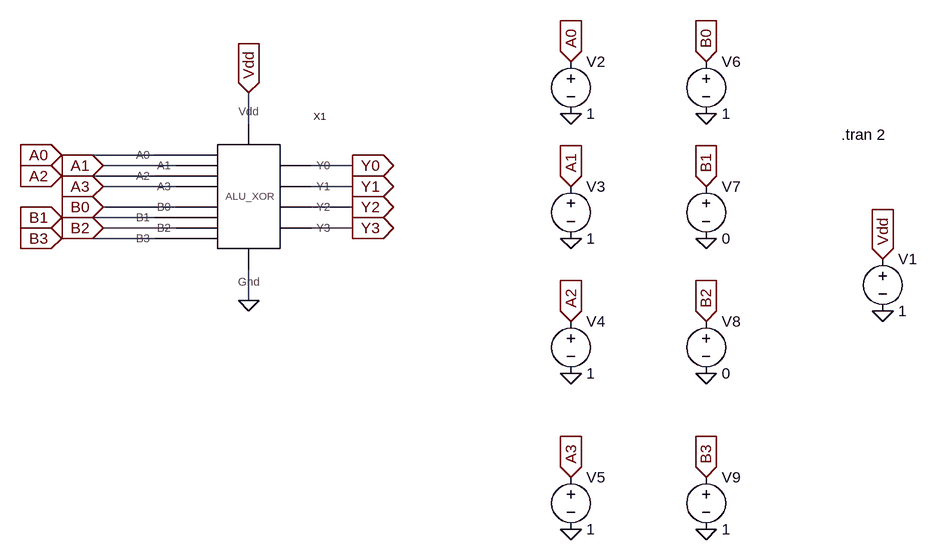
[diagram p0: schematic ALU_XOR_Test.asc]
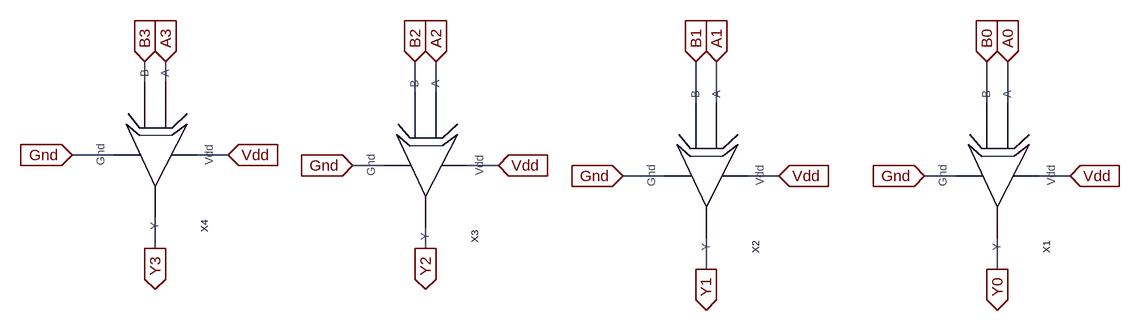
[diagram p1: sub-circuit alu_xor.asc]
ALU_XOR_Test.asc, the LTspice schematic file:
Version 4
SHEET 1 1368 932
WIRE 320 48 320 0
WIRE 176 96 32 96
WIRE 208 112 96 112
WIRE 480 112 416 112
WIRE 176 128 32 128
WIRE 208 144 96 144
WIRE 480 144 416 144
WIRE 208 176 96 176
WIRE 480 176 416 176
WIRE 176 192 32 192
WIRE 208 208 96 208
WIRE 480 208 416 208
WIRE 176 224 32 224
WIRE 320 320 320 272
FLAG 320 0 Vdd
IOPIN 320 0 In
FLAG 32 96 A0
IOPIN 32 96 In
FLAG 96 112 A1
IOPIN 96 112 In
FLAG 32 128 A2
IOPIN 32 128 In
FLAG 96 144 A3
IOPIN 96 144 In
FLAG 96 176 B0
IOPIN 96 176 In
FLAG 32 192 B1
IOPIN 32 192 In
FLAG 96 208 B2
IOPIN 96 208 In
FLAG 32 224 B3
IOPIN 32 224 In
FLAG 480 112 Y0
IOPIN 480 112 Out
FLAG 480 144 Y1
IOPIN 480 144 Out
FLAG 480 176 Y2
IOPIN 480 176 Out
FLAG 480 208 Y3
IOPIN 480 208 Out
FLAG 320 320 0
FLAG 1296 256 Vdd
IOPIN 1296 256 In
FLAG 1296 336 0
FLAG 816 -48 A0
IOPIN 816 -48 In
FLAG 816 144 A1
IOPIN 816 144 In
FLAG 816 352 A2
IOPIN 816 352 In
FLAG 816 592 A3
IOPIN 816 592 In
FLAG 1024 -48 B0
IOPIN 1024 -48 In
FLAG 1024 144 B1
IOPIN 1024 144 In
FLAG 1024 352 B2
IOPIN 1024 352 In
FLAG 1024 592 B3
IOPIN 1024 592 In
FLAG 816 32 0
FLAG 1024 32 0
FLAG 816 224 0
FLAG 1024 224 0
FLAG 816 432 0
FLAG 1024 432 0
FLAG 1024 672 0
FLAG 816 672 0
SYMBOL ALU_XOR 336 144 R0
SYMATTR InstName X1
SYMBOL voltage 1296 240 R0
WINDOW 123 0 0 Left 0
WINDOW 39 0 0 Left 0
SYMATTR InstName V1
SYMATTR Value 1
SYMBOL voltage 816 -64 R0
WINDOW 123 0 0 Left 0
WINDOW 39 0 0 Left 0
SYMATTR InstName V2
SYMATTR Value 1
SYMBOL voltage 816 128 R0
WINDOW 123 0 0 Left 0
WINDOW 39 0 0 Left 0
SYMATTR InstName V3
SYMATTR Value 1
SYMBOL voltage 816 336 R0
WINDOW 123 0 0 Left 0
WINDOW 39 0 0 Left 0
SYMATTR InstName V4
SYMATTR Value 1
SYMBOL voltage 816 576 R0
WINDOW 123 0 0 Left 0
WINDOW 39 0 0 Left 0
SYMATTR InstName V5
SYMATTR Value 1
SYMBOL voltage 1024 -64 R0
WINDOW 123 0 0 Left 0
WINDOW 39 0 0 Left 0
SYMATTR InstName V6
SYMATTR Value 1
SYMBOL voltage 1024 128 R0
WINDOW 123 0 0 Left 0
WINDOW 39 0 0 Left 0
SYMATTR InstName V7
SYMATTR Value 0
SYMBOL voltage 1024 336 R0
WINDOW 123 0 0 Left 0
WINDOW 39 0 0 Left 0
SYMATTR InstName V8
SYMATTR Value 0
SYMBOL voltage 1024 576 R0
WINDOW 123 0 0 Left 0
WINDOW 39 0 0 Left 0
SYMATTR InstName V9
SYMATTR Value 1
TEXT 1232 64 Left 2 !.tran 2

alu_xor.asc, the sub-circuit schematic file:
Version 4
SHEET 1 880 680
WIRE -800 48 -800 16
WIRE -768 48 -768 16
WIRE -384 64 -384 16
WIRE -352 64 -352 16
WIRE 48 80 48 16
WIRE 80 80 80 16
WIRE 496 80 496 16
WIRE 528 80 528 16
WIRE -848 160 -912 160
WIRE -672 160 -720 160
WIRE -432 176 -480 176
WIRE -256 176 -304 176
WIRE 0 192 -64 192
WIRE 176 192 128 192
WIRE 448 192 400 192
WIRE 624 192 576 192
WIRE -784 304 -784 256
WIRE -368 304 -368 272
WIRE 64 336 64 288
WIRE 512 336 512 288
FLAG 512 336 Y0
IOPIN 512 336 Out
FLAG 64 336 Y1
IOPIN 64 336 Out
FLAG -368 304 Y2
IOPIN -368 304 Out
FLAG -784 304 Y3
IOPIN -784 304 Out
FLAG 528 16 A0
IOPIN 528 16 In
FLAG 80 16 A1
IOPIN 80 16 In
FLAG -352 16 A2
IOPIN -352 16 In
FLAG -768 16 A3
IOPIN -768 16 In
FLAG 496 16 B0
IOPIN 496 16 In
FLAG 48 16 B1
IOPIN 48 16 In
FLAG -384 16 B2
IOPIN -384 16 In
FLAG -800 16 B3
IOPIN -800 16 In
FLAG 176 192 Vdd
IOPIN 176 192 In
FLAG 624 192 Vdd
IOPIN 624 192 In
FLAG -256 176 Vdd
IOPIN -256 176 In
FLAG -672 160 Vdd
IOPIN -672 160 In
FLAG 400 192 Gnd
IOPIN 400 192 In
FLAG -64 192 Gnd
IOPIN -64 192 In
FLAG -480 176 Gnd
IOPIN -480 176 In
FLAG -912 160 Gnd
IOPIN -912 160 In
SYMBOL XOR1 528 160 R90
SYMATTR InstName X1
SYMBOL XOR1 80 160 R90
SYMATTR InstName X2
SYMBOL XOR1 -352 144 R90
SYMATTR InstName X3
SYMBOL XOR1 -768 128 R90
SYMATTR InstName X4

The netlist it stands for:
* ALU_XOR_Test.asc
XX1 A0 A1 A2 A3 B0 B1 B2 B3 Vdd 0 Y0 Y1 Y2 Y3 alu_xor
V1 Vdd 0 1
V2 A0 0 1
V3 A1 0 1
V4 A2 0 1
V5 A3 0 1
V6 B0 0 1
V7 B1 0 0
V8 B2 0 0
V9 B3 0 1

* block symbol definitions
.subckt alu_xor A0 A1 A2 A3 B0 B1 B2 B3 Vdd Gnd Y0 Y1 Y2 Y3
XX1 Vdd Gnd A0 B0 Y0 XOR1  ; pins Vdd Gnd A B Y
XX2 Vdd Gnd A1 B1 Y1 XOR1  ; pins Vdd Gnd A B Y
XX3 Vdd Gnd A2 B2 Y2 XOR1  ; pins Vdd Gnd A B Y
XX4 Vdd Gnd A3 B3 Y3 XOR1  ; pins Vdd Gnd A B Y
.ends alu_xor

.tran 2
.backanno
.end